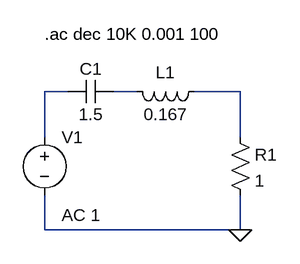
[diagram p0: schematic EJE3.asc]
EJE3.asc, the LTspice schematic file:
Version 4
SHEET 1 880 680
WIRE 80 96 48 96
WIRE 176 96 144 96
WIRE 320 96 256 96
WIRE 48 160 48 96
WIRE 320 160 320 96
WIRE 48 288 48 240
WIRE 320 288 320 240
WIRE 320 288 48 288
FLAG 320 288 0
SYMBOL cap 144 80 R90
WINDOW 0 0 32 VBottom 2
WINDOW 3 32 32 VTop 2
SYMATTR InstName C1
SYMATTR Value 1.5
SYMBOL ind 272 80 R90
WINDOW 0 5 56 VBottom 2
WINDOW 3 32 56 VTop 2
SYMATTR InstName L1
SYMATTR Value 0.167
SYMBOL res 304 144 R0
SYMATTR InstName R1
SYMATTR Value 1
SYMBOL voltage 48 144 R0
WINDOW 123 24 124 Left 2
WINDOW 39 0 0 Left 0
SYMATTR InstName V1
SYMATTR Value ""
SYMATTR Value2 AC 1
TEXT 48 16 Left 2 !.ac dec 10K 0.001 100

The netlist it stands for:
* EJE3.asc
C1 N002 N001 1.5
L1 N003 N002 0.167
R1 N003 0 1
V1 N001 0 AC 1
.ac dec 10K 0.001 100
.backanno
.end